# Altium schematic sheet LPCB235 - AUX POWER.SchDoc
size A3; Address1: Factory 10; Address2: 9-13 Dingley Avenue, Dandeong, VICTORIA 3175, AUSTRALIA; DocumentNumber: 6; Revision: 1; SheetNumber: 6; SheetTotal: 37; Lockie__PCB_SUB_ASSEMBLY: Power Supplies; Lockie__PCB_ASSEMBLY: FCU PCB; Lockie__LDL: LPCB235; Lockie__PCB_DESCRIPTION: Flight Control Unit
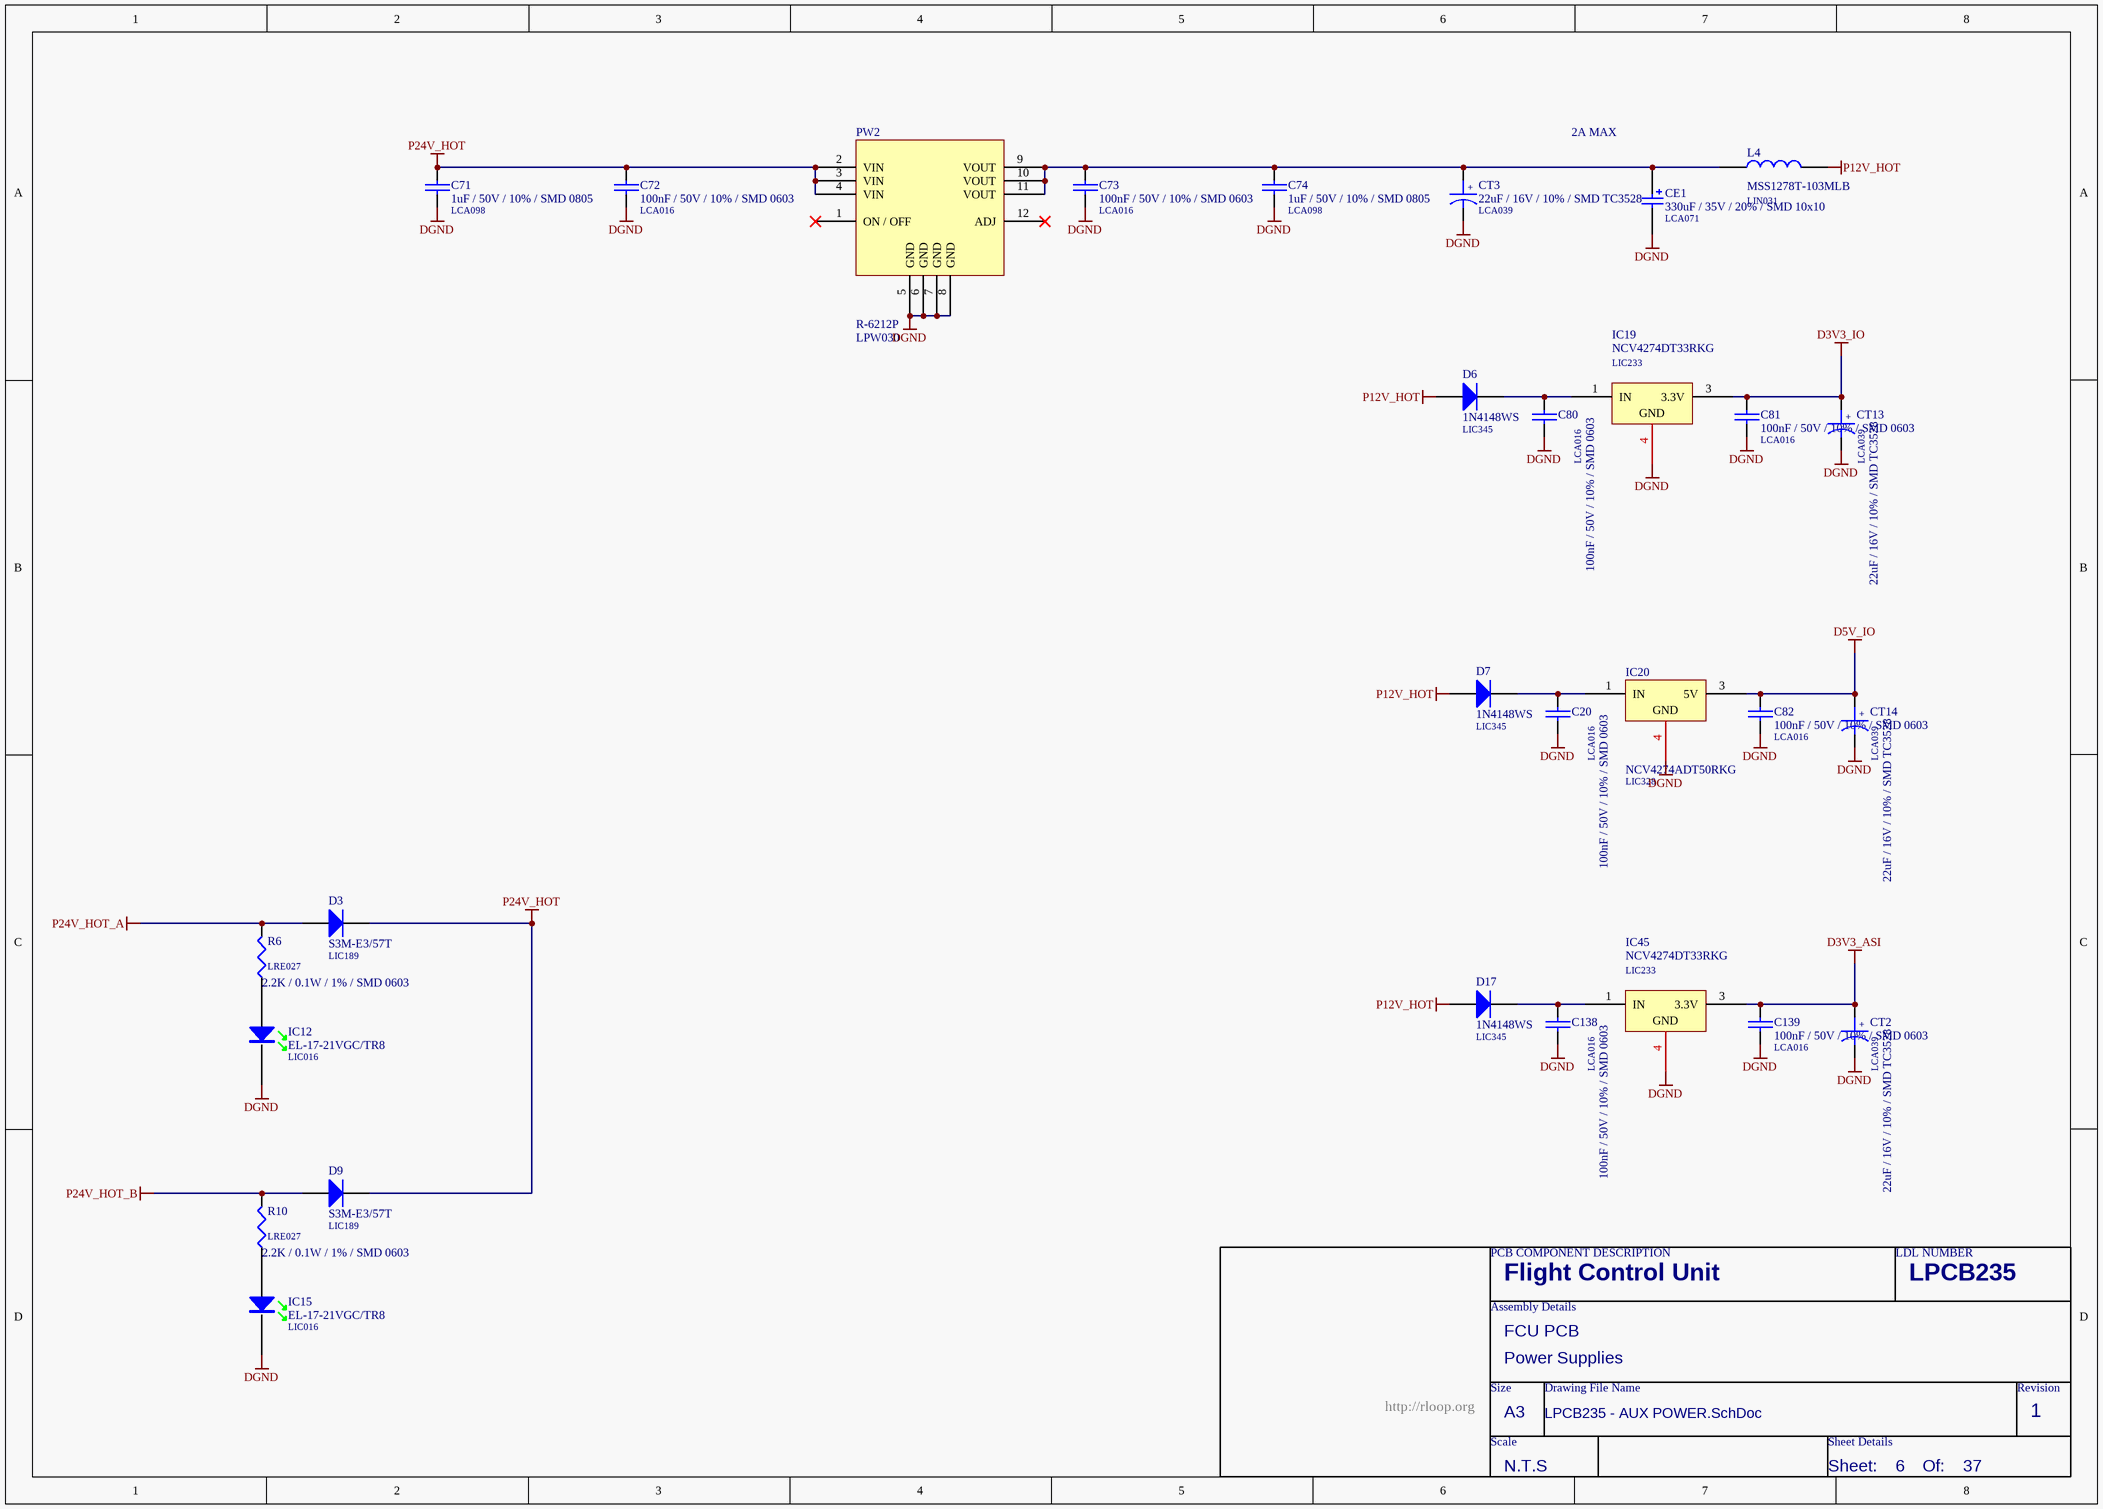
[diagram p0: LPCB235 - AUX POWER.SchDoc]

## Parts
C20  100nF / 50V / 10% / SMD 0603  LDL_NUMBER: LCA016  [LFP011__CC1608-0603-IPC7351_B]
C71  1uF / 50V / 10% / SMD 0805  LDL_NUMBER: LCA098  [LFP010__CC2012-0805-IPC7351_B]
C72  100nF / 50V / 10% / SMD 0603  LDL_NUMBER: LCA016  [LFP011__CC1608-0603-IPC7351_B]
C73  100nF / 50V / 10% / SMD 0603  LDL_NUMBER: LCA016  [LFP011__CC1608-0603-IPC7351_B]
C74  1uF / 50V / 10% / SMD 0805  LDL_NUMBER: LCA098  [LFP010__CC2012-0805-IPC7351_B]
C80  100nF / 50V / 10% / SMD 0603  LDL_NUMBER: LCA016  [LFP011__CC1608-0603-IPC7351_B]
C81  100nF / 50V / 10% / SMD 0603  LDL_NUMBER: LCA016  [LFP011__CC1608-0603-IPC7351_B]
C82  100nF / 50V / 10% / SMD 0603  LDL_NUMBER: LCA016  [LFP011__CC1608-0603-IPC7351_B]
C138  100nF / 50V / 10% / SMD 0603  LDL_NUMBER: LCA016  [LFP011__CC1608-0603-IPC7351_B]
C139  100nF / 50V / 10% / SMD 0603  LDL_NUMBER: LCA016  [LFP011__CC1608-0603-IPC7351_B]
CE1  330uF / 35V / 20% / SMD 10x10  LDL_NUMBER: LCA071  [LFP041__NICHICON_WT_10X10]
CT2  22uF / 16V / 10% / SMD TC3528  LDL_NUMBER: LCA039  [LFP018__TC3528]
CT3  22uF / 16V / 10% / SMD TC3528  LDL_NUMBER: LCA039  [LFP018__TC3528]
CT13  22uF / 16V / 10% / SMD TC3528  LDL_NUMBER: LCA039  [LFP018__TC3528]
CT14  22uF / 16V / 10% / SMD TC3528  LDL_NUMBER: LCA039  [LFP018__TC3528]
D3  S3M-E3/57T  LDL_NUMBER: LIC189  [LFP040__DO-214AB]
D6  1N4148WS  LDL_NUMBER: LIC345  [LFP001__SOD-323F]
D7  1N4148WS  LDL_NUMBER: LIC345  [LFP001__SOD-323F]
D9  S3M-E3/57T  LDL_NUMBER: LIC189  [LFP040__DO-214AB]
D17  1N4148WS  LDL_NUMBER: LIC345  [LFP001__SOD-323F]
IC12  EL-17-21VGC/TR8  LDL_NUMBER: LIC016  [CR2012-0805-LED]
IC15  EL-17-21VGC/TR8  LDL_NUMBER: LIC016  [CR2012-0805-LED]
IC19  NCV4274DT33RKG  LDL_NUMBER: LIC233  [LFP019__369A-13]
IC20  NCV4274ADT50RKG  LDL_NUMBER: LIC328  [LFP019__369A-13]
IC45  NCV4274DT33RKG  LDL_NUMBER: LIC233  [LFP019__369A-13]
L4  MSS1278T-103MLB  LDL_NUMBER: LIN031  [LFP037__MSS1278T]
PW2  R-6212P  LDL_NUMBER: LPW030  [R-625.0P]
R6  2.2K / 0.1W / 1% / SMD 0603  LDL_NUMBER: LRE027  [LFP020__CR1608-0603-IPC7351_B]
R10  2.2K / 0.1W / 1% / SMD 0603  LDL_NUMBER: LRE027  [LFP020__CR1608-0603-IPC7351_B]

## Nets
D3V3_ASI: C139.1 CT2.1 IC45.3(3.3V)
D3V3_IO: C81.1 CT13.1 IC19.3(3.3V)
D5V_IO: C82.1 CT14.1 IC20.3(5V)
DGND: C20.2 C71.2 C72.2 C73.2 C74.2 C80.2 C81.2 C82.2 C138.2 C139.2 CE1.2 CT2.2 CT3.2 CT13.2 CT14.2 IC12.K IC15.K IC19.4(GND) IC20.4(ADJ) IC45.4(GND) PW2.5(GND) PW2.6(GND) PW2.7(GND) PW2.8(GND)
P12V_HOT: D6.2(A) D7.2(A) D17.2(A) L4.2
P24V_HOT: C71.1 C72.1 D3.1(K) D9.1(K) PW2.2(VIN) PW2.3(VIN) PW2.4(VIN)
P24V_HOT_A: D3.2(A) R6.2
P24V_HOT_B: D9.2(A) R10.2
NetC20_1: C20.1 D7.1(K) IC20.1(IN)
NetC73_1: C73.1 C74.1 CE1.1 CT3.1 L4.1 PW2.9(VOUT) PW2.10(VOUT) PW2.11(VOUT)
NetC80_1: C80.1 D6.1(K) IC19.1(IN)
NetC138_1: C138.1 D17.1(K) IC45.1(IN)
NetIC12_A: IC12.A R6.1
NetIC15_A: IC15.A R10.1

Not connected (* = marked no-connect by the designer): PW2 1(ON_/_OFF)* 12(ADJ)*

## Notes on the sheet
- 2A MAX
- PCB COMPONENT DESCRIPTION
- LDL NUMBER
- Assembly Details
- Size
- Drawing File Name
- Revision
- http://rloop.org
- Scale
- A3
- Sheet Details
- N.T.S
- Sheet:
- Of:
- (in symbol 22uF / 16V / 10% / SMD TC3528) +
- (in symbol NCV4274ADT50RKG) GND

## Library data of the parts
C20 C72 C73 C80-C82 C138 C139 = 100nF / 50V / 10% / SMD 0603: Capacitor, Ceramic Chip, 100nF (0.1uF), 50V, 5%, SMD 0603 [LCA016]; Value: 100n; FMEDA__OPERATING__VOLTAGE_MIN: 0; FMEDA__OPERATING__VOLTAGE_MAX: 3.3; FMEDA__OPERATING__TEMP_MIN: -20; FMEDA__OPERATING__TEMP_TYP: 27; FMEDA__OPERATING__TEMP_MAX: 50; FMEDA__CHANNEL: COM; FMEDA__FUNCTION_IN_SYSTEM: *; FMEDA__OPERATING__VOLTAGE_TYP: 3.3
C71 C74 = 1uF / 50V / 10% / SMD 0805: Capacitor, Ceramic Chip, 1uF, 50V, SMD 0805 [LCA098]; Value: 1u; FMEDA__OPERATING__VOLTAGE_MAX: 3.3; FMEDA__OPERATING__VOLTAGE_MIN: 0; FMEDA__OPERATING__TEMP_MAX: 50; FMEDA__OPERATING__TEMP_MIN: -20; FMEDA__OPERATING__TEMP_TYP: 27; FMEDA__CHANNEL: COM; FMEDA__OPERATING__VOLTAGE_TYP: 3.3; FMEDA__FUNCTION_IN_SYSTEM: *
CE1 = 330uF / 35V / 20% / SMD 10x10: Capacitor, Aluminum Electrolytic, 330uF, 35V, 20%, SMD (10mm x 10mm) [LCA071]; FMEDA__OPERATING__TEMP_MAX: 50; FMEDA__OPERATING__TEMP_MIN: -20; FMEDA__OPERATING__TEMP_TYP: 27; FMEDA__OPERATING__VOLTAGE_MAX: 0; Value: 330u; FMEDA__CHANNEL: COM; FMEDA__OPERATING__VOLTAGE_MIN: 0; FMEDA__OPERATING__VOLTAGE_TYP: 0; FMEDA__FUNCTION_IN_SYSTEM: *
CT2 CT3 CT13 CT14 = 22uF / 16V / 10% / SMD TC3528: Capacitor, Tantalum, 22uF, 16V, 10%, SMD TC3528 (BCASE) [LCA039]; Value: 22u; FMEDA__OPERATING__VOLTAGE_MAX: 3.3; FMEDA__OPERATING__VOLTAGE_MIN: 0; FMEDA__OPERATING__TEMP_MAX: 50; FMEDA__OPERATING__TEMP_MIN: -20; FMEDA__OPERATING__TEMP_TYP: 27; FMEDA__CHANNEL: COM; FMEDA__OPERATING__VOLTAGE_TYP: 3.3; FMEDA__FUNCTION_IN_SYSTEM: *
D3 D9 = S3M-E3/57T: Diode, General Purpose Rectifier, 3A, 200V, SMD DO-214AB [LIC189]; FMEDA__OPERATING__CURRENT_MAX: 0; FMEDA__OPERATING__TEMP_MAX: 50; FMEDA__OPERATING__TEMP_MIN: -20; FMEDA__OPERATING__TEMP_TYP: 27; FMEDA__CHANNEL: COM; FMEDA__OPERATING__CURRENT_MIN: 0; FMEDA__OPERATING__CURRENT_TYP: 0; FMEDA__OPERATING__VOLTAGE_MAX: 0; FMEDA__OPERATING__VOLTAGE_MIN: 0; FMEDA__OPERATING__VOLTAGE_TYP: 0; FMEDA__FUNCTION_IN_SYSTEM: *
D6 D7 D17 = 1N4148WS: Diode, Small Signal, SMD SOD-323F [LIC345]; FMEDA__FUNCTION_IN_SYSTEM: ACCEL PSU INPUT DIODE; FMEDA__OPERATING__TEMP_MAX: 50; FMEDA__OPERATING__TEMP_MIN: -20; FMEDA__OPERATING__TEMP_TYP: 27; FMEDA__OPERATING__VOLTAGE_MAX: 0; FMEDA__CHANNEL: COM; FMEDA__OPERATING__VOLTAGE_MIN: 0; FMEDA__OPERATING__VOLTAGE_TYP: 0; FMEDA__OPERATING__CURRENT_MAX: 0; FMEDA__OPERATING__CURRENT_MIN: 0; FMEDA__OPERATING__CURRENT_TYP: 0
IC12 IC15 = EL-17-21VGC/TR8: LED, SMD, 0805 Green [LIC016]; FMEDA__OPERATING__TEMP_MAX: 50; FMEDA__OPERATING__TEMP_MIN: -20; FMEDA__OPERATING__TEMP_TYP: 27; FMEDA__CHANNEL: COM; FMEDA__FUNCTION_IN_SYSTEM: *
IC19 IC45 = NCV4274DT33RKG: IC, Voltage Regulator, 400mA, 3.3V LDO, SMD DPAK [LIC233]; FMEDA__OPERATING__OUTPUT_CURRENT_MIN: 0; FMEDA__OPERATING__TEMP_MAX: 50; FMEDA__OPERATING__TEMP_MIN: -20; FMEDA__OPERATING__TEMP_TYP: 27; VALUE: 0; Note: Obey Thermal Design Rules; FMEDA__CHANNEL: COM; FMEDA__OPERATING__OUTPUT_CURRENT_TYP: 0; FMEDA__OPERATING__VOLTAGE_MAX: 0; FMEDA__OPERATING__VOLTAGE_MIN: 0; FMEDA__OPERATING__VOLTAGE_TYP: 0; FMEDA__FUNCTION_IN_SYSTEM: *
IC20 = NCV4274ADT50RKG: IC, Voltage Regulator, 400mA, 5V LDO, SMD DPAK [LIC328]; FMEDA__OPERATING__OUTPUT_CURRENT_MIN: 0; FMEDA__OPERATING__TEMP_MAX: 50; FMEDA__OPERATING__TEMP_MIN: -20; FMEDA__OPERATING__TEMP_TYP: 27; VALUE: 0; Note: Obey Thermal Design Rules; FMEDA__CHANNEL: COM; FMEDA__OPERATING__OUTPUT_CURRENT_TYP: 0; FMEDA__OPERATING__VOLTAGE_MAX: 0; FMEDA__OPERATING__VOLTAGE_MIN: 0; FMEDA__OPERATING__VOLTAGE_TYP: 0; FMEDA__FUNCTION_IN_SYSTEM: *
L4 = MSS1278T-103MLB: Inductor, 10uH, 20%, 5.7A, SMD [LIN031]; FMEDA__OPERATING__TEMP_MAX: 50; FMEDA__OPERATING__TEMP_MIN: -20; FMEDA__OPERATING__TEMP_TYP: 27; Value: 10u; FMEDA__CHANNEL: COM; Revision: 1; FMEDA__FUNCTION_IN_SYSTEM: *
PW2 = R-6212P: Non Isolated DC/DC Module
R6 R10 = 2.2K / 0.1W / 1% / SMD 0603: Resistor, Ceramic Chip, 2.2K, 0.1W, 1%, SMD 0603 [LRE027]; FMEDA__OPERATING__VOLTAGE_MIN: 0; FMEDA__OPERATING__TEMP_MIN: -20; FMEDA__OPERATING__TEMP_TYP: 27; FMEDA__OPERATING__TEMP_MAX: 50; FMEDA__CHANNEL: COM; VALUE: 2.2K; FMEDA__OPERATING__VOLTAGE_MAX: 0; FMEDA__OPERATING__POWER_MIN: 0; FMEDA__OPERATING__POWER_MAX: 0; FMEDA__FUNCTION_IN_SYSTEM: *; FMEDA__OPERATING__VOLTAGE_TYP: 0